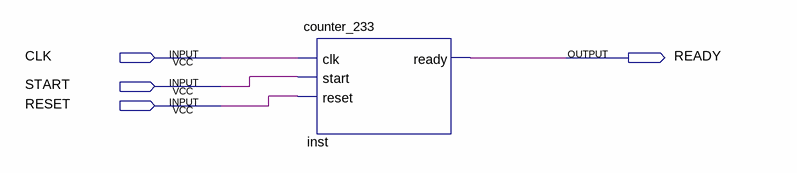
[diagram p0: schematic sheet]
// Quartus schematic LinkedFSM.bdf as structural Verilog: 1 symbols, 4 pins
module LinkedFSM (
  input  CLK,
  input  START,
  input  RESET,
  output READY
);

  counter_233 inst (.clk(CLK), .start(START), .reset(RESET), .ready(READY));
endmodule
